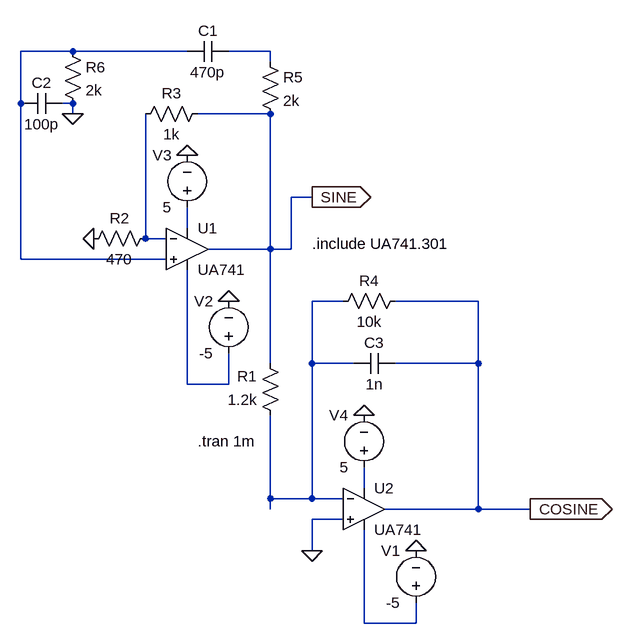
[diagram p0: schematic OSCILLATOR.asc]
OSCILLATOR.asc, the LTspice schematic file:
Version 4
SHEET 1 1124 680
WIRE 192 -304 112 -304
WIRE 368 -304 192 -304
WIRE 496 -304 432 -304
WIRE 496 -288 496 -304
WIRE 112 -224 112 -304
WIRE 192 -224 176 -224
WIRE 192 -208 192 -224
WIRE 496 -208 384 -208
WIRE 560 -80 528 -80
WIRE 368 -32 368 -64
WIRE 304 -16 304 -208
WIRE 336 -16 304 -16
WIRE 496 0 496 -208
WIRE 496 0 400 0
WIRE 528 0 528 -80
WIRE 528 0 496 0
WIRE 112 16 112 -224
WIRE 336 16 112 16
WIRE 608 80 560 80
WIRE 816 80 688 80
WIRE 496 176 496 0
WIRE 560 176 560 80
WIRE 624 176 560 176
WIRE 816 176 816 80
WIRE 816 176 688 176
WIRE 368 208 368 32
WIRE 432 208 432 160
WIRE 432 208 368 208
WIRE 640 368 640 336
WIRE 496 384 496 256
WIRE 560 384 560 176
WIRE 560 384 496 384
WIRE 608 384 560 384
WIRE 496 400 496 384
WIRE 816 400 816 176
WIRE 816 400 672 400
WIRE 896 400 816 400
WIRE 608 416 560 416
WIRE 560 464 560 416
WIRE 640 576 640 432
WIRE 720 576 720 544
WIRE 720 576 640 576
FLAG 720 464 0
FLAG 432 80 0
FLAG 224 -16 0
FLAG 560 464 0
FLAG 368 -144 0
FLAG 640 256 0
FLAG 896 400 COSINE
IOPIN 896 400 Out
FLAG 560 -80 SINE
IOPIN 560 -80 Out
FLAG 192 -208 0
SYMBOL OpAmps\\opamp2 368 -64 R0
SYMATTR InstName U1
SYMATTR Value UA741
SYMBOL OpAmps\\opamp2 640 336 R0
SYMATTR InstName U2
SYMATTR Value UA741
SYMBOL res 512 272 R180
WINDOW 0 36 76 Left 2
WINDOW 3 36 40 Left 2
SYMATTR InstName R1
SYMATTR Value 1.2k
SYMBOL res 320 -32 R90
WINDOW 0 0 56 VBottom 2
WINDOW 3 32 56 VTop 2
SYMATTR InstName R2
SYMATTR Value 470
SYMBOL res 400 -224 R90
WINDOW 0 0 56 VBottom 2
WINDOW 3 32 56 VTop 2
SYMATTR InstName R3
SYMATTR Value 1k
SYMBOL res 704 64 R90
WINDOW 0 0 56 VBottom 2
WINDOW 3 32 56 VTop 2
SYMATTR InstName R4
SYMATTR Value 10k
SYMBOL res 480 -304 R0
SYMATTR InstName R5
SYMATTR Value 2k
SYMBOL cap 432 -320 R90
WINDOW 0 0 32 VBottom 2
WINDOW 3 32 32 VTop 2
SYMATTR InstName C1
SYMATTR Value 470p
SYMBOL res 176 -320 R0
SYMATTR InstName R6
SYMATTR Value 2k
SYMBOL cap 176 -240 R90
WINDOW 0 0 32 VBottom 2
WINDOW 3 32 32 VTop 2
SYMATTR InstName C2
SYMATTR Value 100p
SYMBOL voltage 720 560 R180
WINDOW 0 24 96 Left 2
WINDOW 3 24 16 Left 2
SYMATTR InstName V1
SYMATTR Value -5
SYMBOL voltage 432 176 R180
WINDOW 0 24 96 Left 2
WINDOW 3 24 16 Left 2
SYMATTR InstName V2
SYMATTR Value -5
SYMBOL voltage 368 -48 R180
WINDOW 0 24 96 Left 2
WINDOW 3 24 16 Left 2
SYMATTR InstName V3
SYMATTR Value 5
SYMBOL voltage 640 352 R180
WINDOW 0 24 96 Left 2
WINDOW 3 24 16 Left 2
SYMATTR InstName V4
SYMATTR Value 5
SYMBOL cap 688 160 R90
WINDOW 0 0 32 VBottom 2
WINDOW 3 32 32 VTop 2
SYMATTR InstName C3
SYMATTR Value 1n
TEXT 560 -8 Left 2 !.include UA741.301
TEXT 384 296 Left 2 !.tran 1m

The netlist it stands for:
* OSCILLATOR.asc
XU1 N001 N004 N003 N006 SINE UA741  ; pins In+ In- V+ V- OUT
XU2 0 N005 N007 N008 COSINE UA741  ; pins In+ In- V+ V- OUT
R1 N005 SINE 1.2k
R2 N004 0 470
R3 SINE N004 1k
R4 COSINE N005 10k
R5 N002 SINE 2k
C1 N002 N001 470p
R6 N001 0 2k
C2 0 N001 100p
V1 N008 0 -5
V2 N006 0 -5
V3 N003 0 5
V4 N007 0 5
C3 COSINE N005 1n
.include UA741.301
.tran 1m
.backanno
.end